# Altium schematic sheet BuckConverter.SchDoc
size A
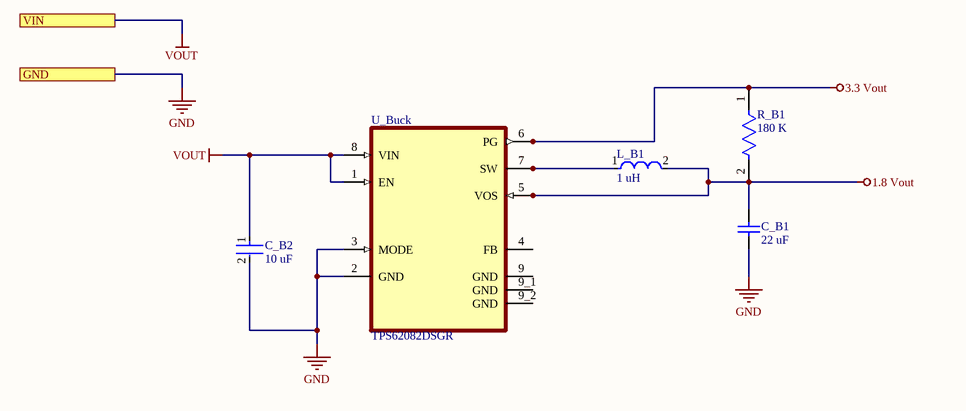
[diagram p0: BuckConverter.SchDoc]

## Parts
C_B1  22 uF  [CAPC1608X100X20ML10]
C_B2  10 uF  [FP-C1608-MFG]
L_B1  1 uH  [FP-LQW15CN_10-MFG]
R_B1  180 K  [FP-CPF0603-MFG]
U_Buck  TPS62082DSGR  [SON50P200X200X80-9N]

## Ports
GND, VIN

## Nets
1.8 Vout: C_B1.2 L_B1.2 R_B1.2 U_Buck.5(VOS)
3.3 Vout: R_B1.1 U_Buck.6(PG)
GND: C_B1.1 C_B2.2 U_Buck.2(GND) U_Buck.3(MODE) ; port GND
VOUT: C_B2.1 U_Buck.1(EN) U_Buck.8(VIN) ; port VIN
NetL_B1_1: L_B1.1 U_Buck.7(SW)

Not connected (* = marked no-connect by the designer): U_Buck 4(FB) 9(GND) 9_1(GND) 9_2(GND)

## Library data of the parts
C_B1 = CMP-2000-05440-1: Chip Capacitor, 22 uF, +/- 20%, 6.3 V, -55 to 85 degC, 1608 (0603 Metric), RoHS, Tape and Reel; PCN Part Number: MLCCPartNumberChange30/Nov/2012; Manufacturer: TDK; Temperature Coefficient: X5R; Product Training Modules: CSeriesGeneralApplicationsSEAT,CCV,andTVCLDesignToolsGuidetoReplacinganElectrolyticCapacitorwithanMLCC; Other Names: 445-8028-1; Capacitance: 22µF; Voltage - Rated: 6.3V; Design Resources: 20WNon-IsolatedBuckLEDDriverUsingPLLNK460KG; Online Catalog: CSeries,GeneralPurpose; Kits: 445-9003-KIT-ND-KITCAPCERHICAPMLCCSMD; Tolerance: ±20%; Series: C; Thickness (Max): 0.039"(1.00mm); Mounting Type: SurfaceMount,MLCC; Ratings: -; Datasheet Version: Mar-15; Package Reference: 603; Packaging: CutTape(CT); Features: -; Package / Case: 0603(1608Metric); Family: CeramicCapacitors; Lead Spacing: -; RoHS Information: RoHSCertificate-MLCC; Manufacturer URL: http://www.tdk.com/; Lead Style: -; Category: Capacitors; Applications: GeneralPurpose; Package Description: 2-Pin Surface Mount Device, Body 1.6 x 0.8 mm; Standard Package: 1; Datasheet URL: http://www.farnell.com/datasheets/1913358.pdf; Height - Seated (Max): -; Operating Temperature: -55degC~85degC; Size / Dimension: 0.063"Lx0.031"W(1.60mmx0.80mm)
C_B2 = CMP-08246-000019-1: CAP CER 10UF 16V X5R 0603; Manufacturer: TDK Corporation; Manufacturer Part Number: C1608X5R1C106M080AB; Temperature Coefficient: 15%; Tolerance: 20%; Octopart: https://octopart.com/c1608x5r1c106m080ab-tdk-26013480; ComponentLink2Description: Datasheet; Value: 10uF; Temperature Range Low: -55°C; Digikey Description: CAP CER 10UF 16V X5R 0603; Package: C1608; Lead Free: Yes; Mouser Description: Multilayer Ceramic Capacitors MLCC - SMD/SMT 0603 10uF 16volts X5R +/-20% GP; Device Class L2: Capacitors; Voltage Rating: 16V; RoHS: TRUE; Automotive: No; Height: 0.9mm; Ipc Land Pattern Name: CAPC16080X80; ComponentLink2URL: https://upverter.com/datasheet/6fbac97fd59b4a24a005814037d2a36a27db40e9.pdf; Temperature Range High: +85°C; Capacitance: 10uF; Temperature: -55°C to +85°C; Category: Cap; Device Class L1: Passive Components; Device Class L3: Ceramic Capacitors; Temperature Characteristic: X5R; Material: Ceramic
L_B1 = CMP-06042-011385-1: Wire Wound Ferrite type RF Inductor 1000nH ±20% 270mA 0.94Ω 0402 (1005); Test Frequency: 100MHz; Inductance: 1uH; Shielding: Unshielded; Self Resonant Frequency: 120MHz; DC Resistance (DCR): 940mR; Tolerance: 20%; Max Operating Temperature: 125°C; Min Operating Temperature: -55°C; Current Rating: 270mA; Case/Package: Nonstandard; Packaging: Cut Tape; Resistor Type: Wirewound; Core Material: Ferrite
R_B1 = CMP-03211-002805-1: RES SMD 180KΩ 0.1% 1/16W 0603; Manufacturer: TE Connectivity; Manufacturer Part Number: CPF0603B180KE; Power Rating: 0.063W; Temperature Coefficient: 25ppm/°C; Voltage Rating: 50V; Octopart: https://octopart.com/cpf0603b180ke-te+connectivity-23257790; Composition: Thin Film; Height: 0.55mm; Series: CPF; Tolerance: 0.1%; Value: 180KΩ; Device Class L3: Chip SMD Resistors; Automotive: No; Temperature Range High: +155°C; Temperature Range Low: -55°C; Package: CPF0603; RoHS: TRUE; Device Class L1: Passive Components; ComponentLink2URL: https://www.te.com/commerce/DocumentDelivery/DDEController?Action=showdoc&DocId=Data+Sheet%7F1773200%7FM%7Fpdf%7FEnglish%7FENG_DS_1773200_M.pdf%7F3-1676481-2; Category: Res; Lead Free: Yes; ComponentLink2Description: Datasheet; packaging: 5k Reel; octopart_url: https://octopart.com/cpf0603b180ke-te+connectivity-23257790; Ipc Land Pattern Name: RESC15580X45; Device Class L2: Resistors; Resistance: 180KΩ; Temperature: -55°C to +155°C
U_Buck = TPS62082DSGR: 1.2A High Efficient Step Down Converter in 2x2mm SON Package. 3.3 Vout (Min) 8-WSON -40 to 125; MF: Texas Instruments; SnapEDA_Link: https://www.snapeda.com/parts/TPS62082DSGR/Texas%20Instruments/view-part/232318/?ref=snap; Digi-Key_Part_Number: 296-49331-1-ND; Purchase-URL: https://pricing.snapeda.com/search/part/TPS62082DSGR/?ref=eda; Value: *; MP: TPS62082DSGR; Package: WSON-8 Texas Instruments; Check_prices: https://www.snapeda.com/parts/TPS62082DSGR/Texas%20Instruments/view-part/232318/?ref=eda